# Altium project Capstone_Chess_Board.PrjPcb
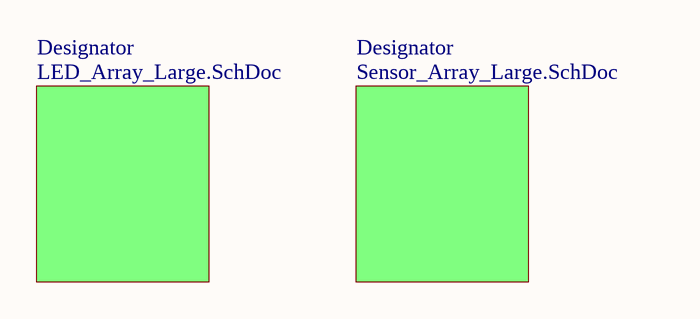
[diagram p0: Power_Supply_And_Connections.SchDoc]
4 sheets, 314 parts. Net scope: flat (ports and power ports of the same name join across sheets).
Board file: Chess_Board.PcbDoc
Sheets:
  Power_Supply_And_Connections.SchDoc
    Designator = LED_Array_Large.SchDoc
    Designator = Sensor_Array_Large.SchDoc
  Sensor_Array_No_Diodes.SchDoc

## Sheet Power_Supply_And_Connections.SchDoc
size A

### Sub-sheets
Designator = LED_Array_Large.SchDoc: no entries
Designator = Sensor_Array_Large.SchDoc: no entries

## Sheet LED_Array_Large.SchDoc
size C
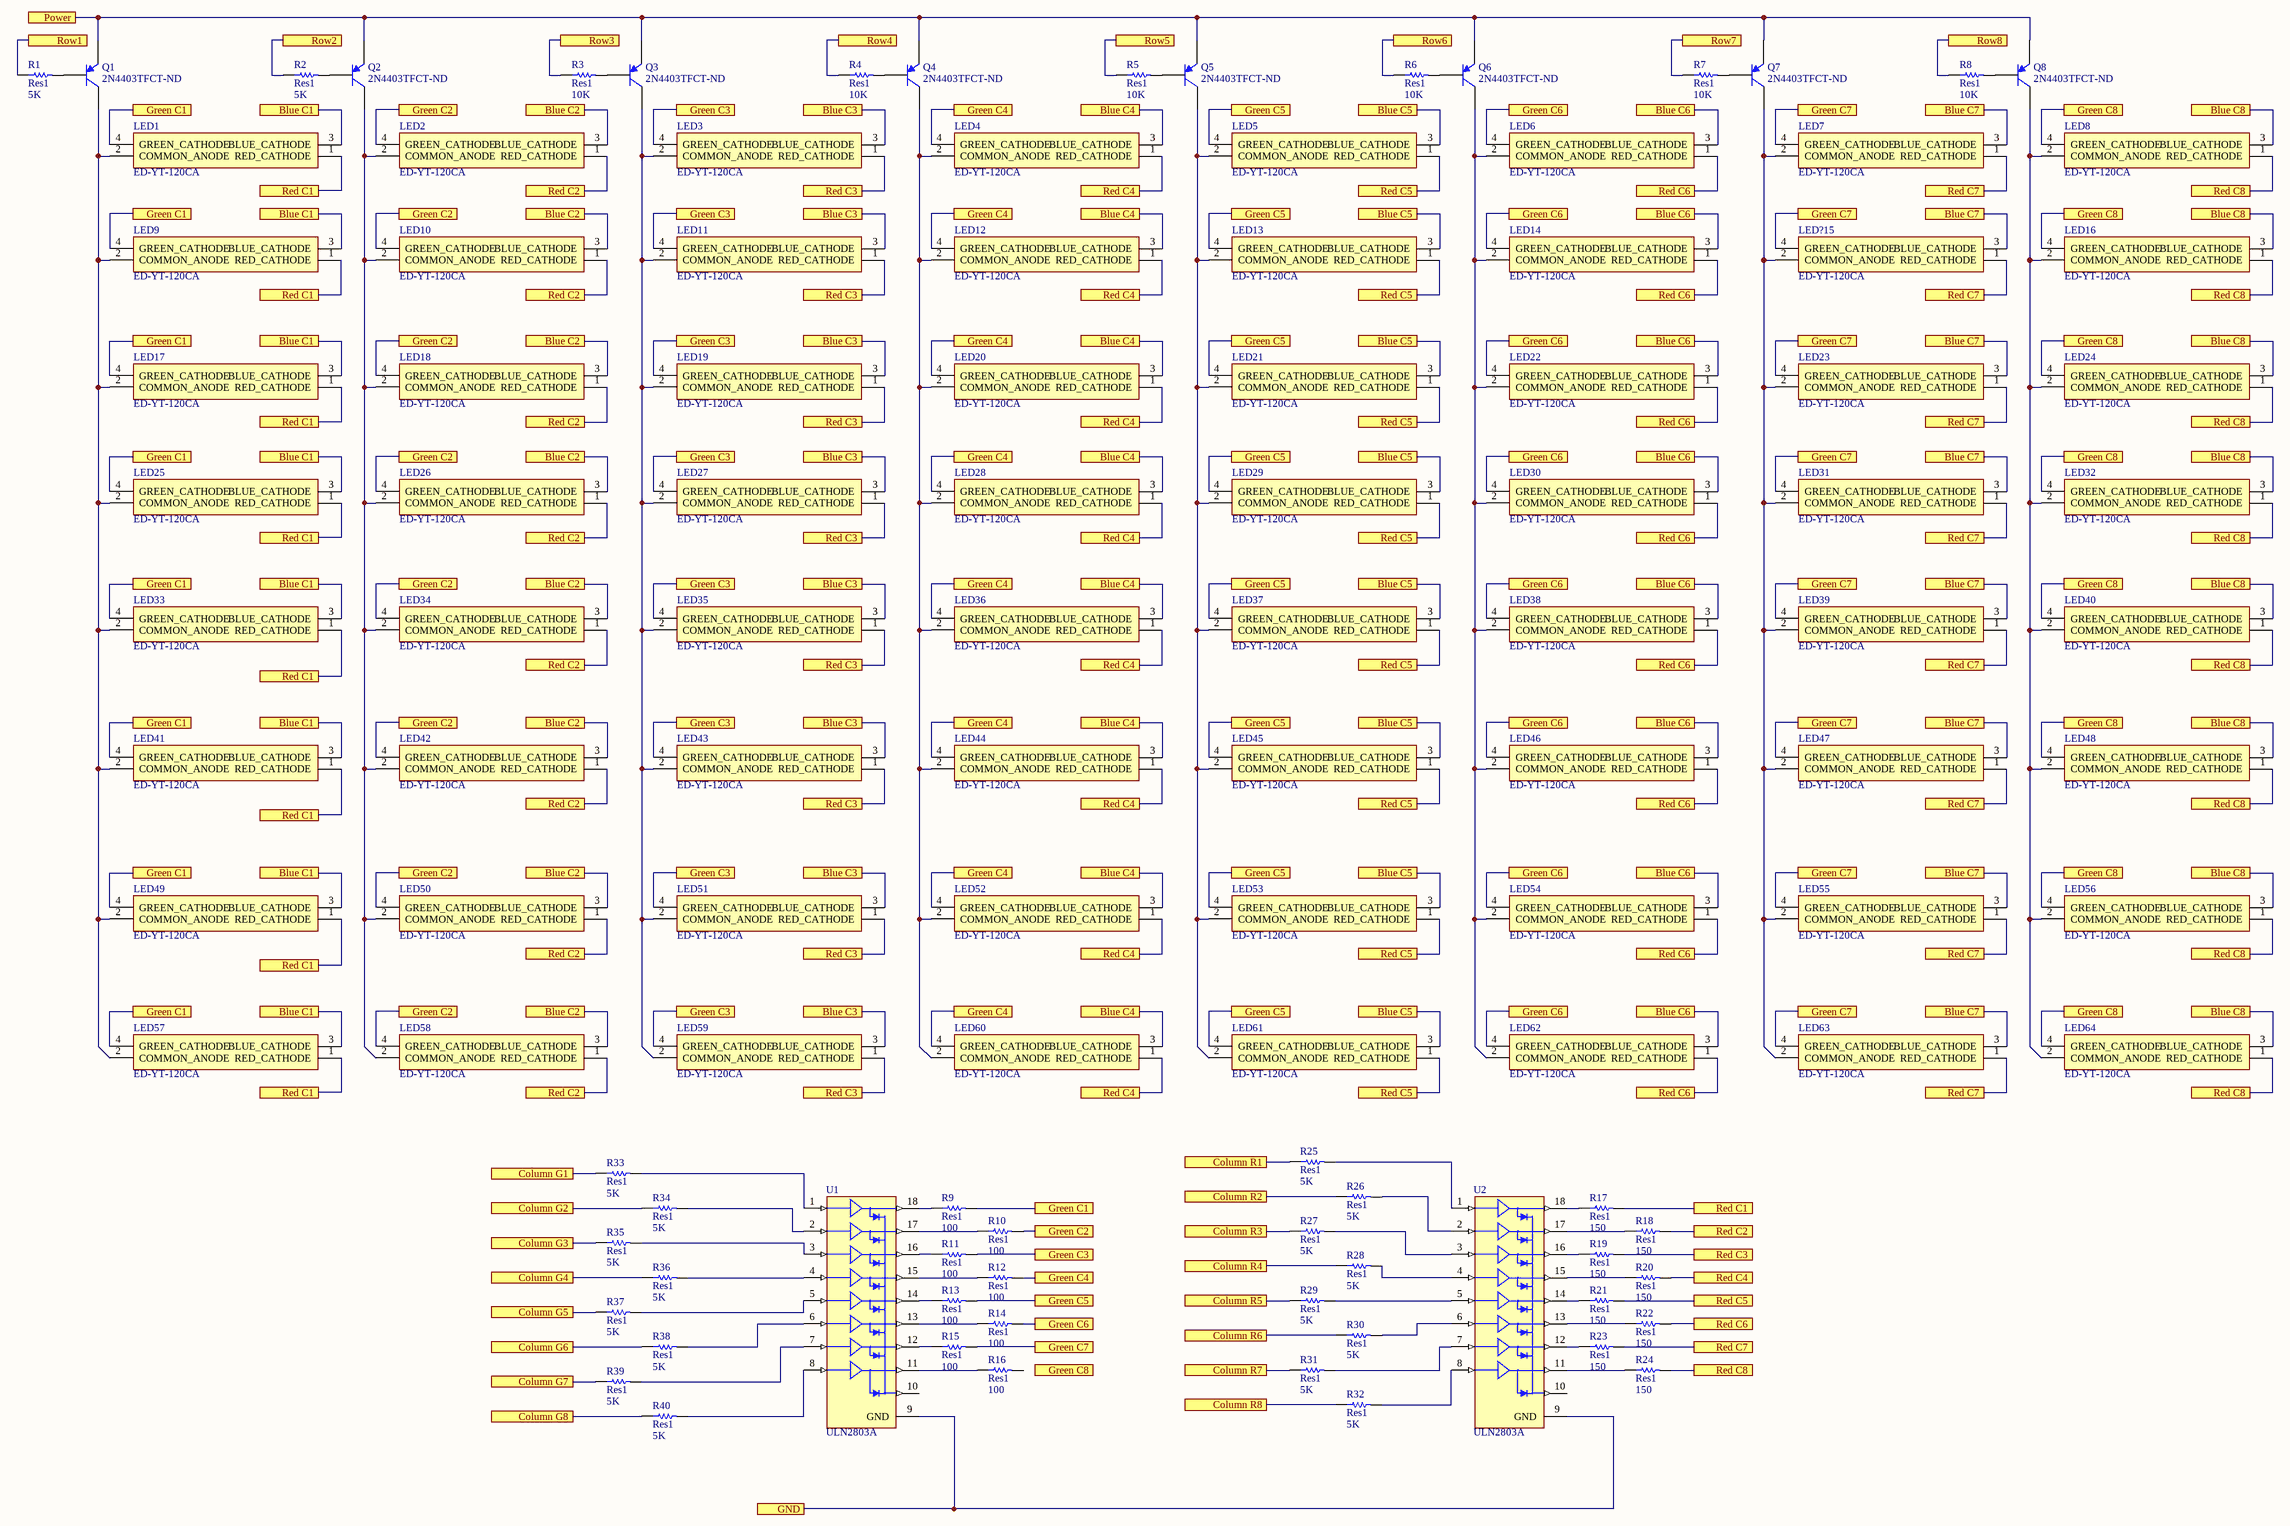
[diagram p1: LED_Array_Large.SchDoc]

### Parts
LED1  ED-YT-120CA  [L-154A4SUREQBFZGEC]
LED2  ED-YT-120CA  [L-154A4SUREQBFZGEC]
LED3  ED-YT-120CA  [L-154A4SUREQBFZGEC]
LED4  ED-YT-120CA  [L-154A4SUREQBFZGEC]
LED5  ED-YT-120CA  [L-154A4SUREQBFZGEC]
LED6  ED-YT-120CA  [L-154A4SUREQBFZGEC]
LED7  ED-YT-120CA  [L-154A4SUREQBFZGEC]
LED8  ED-YT-120CA  [L-154A4SUREQBFZGEC]
LED9  ED-YT-120CA  [L-154A4SUREQBFZGEC]
LED10  ED-YT-120CA  [L-154A4SUREQBFZGEC]
LED11  ED-YT-120CA  [L-154A4SUREQBFZGEC]
LED12  ED-YT-120CA  [L-154A4SUREQBFZGEC]
LED13  ED-YT-120CA  [L-154A4SUREQBFZGEC]
LED14  ED-YT-120CA  [L-154A4SUREQBFZGEC]
LED16  ED-YT-120CA  [L-154A4SUREQBFZGEC]
LED17  ED-YT-120CA  [L-154A4SUREQBFZGEC]
LED18  ED-YT-120CA  [L-154A4SUREQBFZGEC]
LED19  ED-YT-120CA  [L-154A4SUREQBFZGEC]
LED20  ED-YT-120CA  [L-154A4SUREQBFZGEC]
LED21  ED-YT-120CA  [L-154A4SUREQBFZGEC]
LED22  ED-YT-120CA  [L-154A4SUREQBFZGEC]
LED23  ED-YT-120CA  [L-154A4SUREQBFZGEC]
LED24  ED-YT-120CA  [L-154A4SUREQBFZGEC]
LED25  ED-YT-120CA  [L-154A4SUREQBFZGEC]
LED26  ED-YT-120CA  [L-154A4SUREQBFZGEC]
LED27  ED-YT-120CA  [L-154A4SUREQBFZGEC]
LED28  ED-YT-120CA  [L-154A4SUREQBFZGEC]
LED29  ED-YT-120CA  [L-154A4SUREQBFZGEC]
LED30  ED-YT-120CA  [L-154A4SUREQBFZGEC]
LED31  ED-YT-120CA  [L-154A4SUREQBFZGEC]
LED32  ED-YT-120CA  [L-154A4SUREQBFZGEC]
LED33  ED-YT-120CA  [L-154A4SUREQBFZGEC]
LED34  ED-YT-120CA  [L-154A4SUREQBFZGEC]
LED35  ED-YT-120CA  [L-154A4SUREQBFZGEC]
LED36  ED-YT-120CA  [L-154A4SUREQBFZGEC]
LED37  ED-YT-120CA  [L-154A4SUREQBFZGEC]
LED38  ED-YT-120CA  [L-154A4SUREQBFZGEC]
LED39  ED-YT-120CA  [L-154A4SUREQBFZGEC]
LED40  ED-YT-120CA  [L-154A4SUREQBFZGEC]
LED41  ED-YT-120CA  [L-154A4SUREQBFZGEC]
LED42  ED-YT-120CA  [L-154A4SUREQBFZGEC]
LED43  ED-YT-120CA  [L-154A4SUREQBFZGEC]
LED44  ED-YT-120CA  [L-154A4SUREQBFZGEC]
LED45  ED-YT-120CA  [L-154A4SUREQBFZGEC]
LED46  ED-YT-120CA  [L-154A4SUREQBFZGEC]
LED47  ED-YT-120CA  [L-154A4SUREQBFZGEC]
LED48  ED-YT-120CA  [L-154A4SUREQBFZGEC]
LED49  ED-YT-120CA  [L-154A4SUREQBFZGEC]
LED50  ED-YT-120CA  [L-154A4SUREQBFZGEC]
LED51  ED-YT-120CA  [L-154A4SUREQBFZGEC]
LED52  ED-YT-120CA  [L-154A4SUREQBFZGEC]
LED53  ED-YT-120CA  [L-154A4SUREQBFZGEC]
LED54  ED-YT-120CA  [L-154A4SUREQBFZGEC]
LED55  ED-YT-120CA  [L-154A4SUREQBFZGEC]
LED56  ED-YT-120CA  [L-154A4SUREQBFZGEC]
LED57  ED-YT-120CA  [L-154A4SUREQBFZGEC]
LED58  ED-YT-120CA  [L-154A4SUREQBFZGEC]
LED59  ED-YT-120CA  [L-154A4SUREQBFZGEC]
LED60  ED-YT-120CA  [L-154A4SUREQBFZGEC]
LED61  ED-YT-120CA  [L-154A4SUREQBFZGEC]
LED62  ED-YT-120CA  [L-154A4SUREQBFZGEC]
LED63  ED-YT-120CA  [L-154A4SUREQBFZGEC]
LED64  ED-YT-120CA  [L-154A4SUREQBFZGEC]
LED?15  ED-YT-120CA  [L-154A4SUREQBFZGEC]
Q1  2N4403TFCT-ND  [TO-92A]
Q2  2N4403TFCT-ND  [TO-92A]
Q3  2N4403TFCT-ND  [TO-92A]
Q4  2N4403TFCT-ND  [TO-92A]
Q5  2N4403TFCT-ND  [TO-92A]
Q6  2N4403TFCT-ND  [TO-92A]
Q7  2N4403TFCT-ND  [TO-92A]
Q8  2N4403TFCT-ND  [TO-92A]
R1  Res1  value 5K  [AXIAL-0.3]
R2  Res1  value 5K  [AXIAL-0.3]
R3  Res1  value 10K  [AXIAL-0.3]
R4  Res1  value 10K  [AXIAL-0.3]
R5  Res1  value 10K  [AXIAL-0.3]
R6  Res1  value 10K  [AXIAL-0.3]
R7  Res1  value 10K  [AXIAL-0.3]
R8  Res1  value 10K  [AXIAL-0.3]
R9  Res1  value 100  [AXIAL-0.3]
R10  Res1  value 100  [AXIAL-0.3]
R11  Res1  value 100  [AXIAL-0.3]
R12  Res1  value 100  [AXIAL-0.3]
R13  Res1  value 100  [AXIAL-0.3]
R14  Res1  value 100  [AXIAL-0.3]
R15  Res1  value 100  [AXIAL-0.3]
R16  Res1  value 100  [AXIAL-0.3]
R17  Res1  value 150  [AXIAL-0.3]
R18  Res1  value 150  [AXIAL-0.3]
R19  Res1  value 150  [AXIAL-0.3]
R20  Res1  value 150  [AXIAL-0.3]
R21  Res1  value 150  [AXIAL-0.3]
R22  Res1  value 150  [AXIAL-0.3]
R23  Res1  value 150  [AXIAL-0.3]
R24  Res1  value 150  [AXIAL-0.3]
R25  Res1  value 5K  [AXIAL-0.3]
R26  Res1  value 5K  [AXIAL-0.3]
R27  Res1  value 5K  [AXIAL-0.3]
R28  Res1  value 5K  [AXIAL-0.3]
R29  Res1  value 5K  [AXIAL-0.3]
R30  Res1  value 5K  [AXIAL-0.3]
R31  Res1  value 5K  [AXIAL-0.3]
R32  Res1  value 5K  [AXIAL-0.3]
R33  Res1  value 5K  [AXIAL-0.3]
R34  Res1  value 5K  [AXIAL-0.3]
R35  Res1  value 5K  [AXIAL-0.3]
R36  Res1  value 5K  [AXIAL-0.3]
R37  Res1  value 5K  [AXIAL-0.3]
R38  Res1  value 5K  [AXIAL-0.3]
R39  Res1  value 5K  [AXIAL-0.3]
R40  Res1  value 5K  [AXIAL-0.3]
U1  ULN2803A  [DIP850W46P254L2324H393Q18]
U2  ULN2803A  [DIP850W46P254L2324H393Q18]

### Ports
Blue C1, Blue C2, Blue C3, Blue C4, Blue C5, Blue C6, Blue C7, Blue C8, Column G1, Column G2, Column G3, Column G4, Column G5, Column G6, Column G7, Column G8, Column R1, Column R2, Column R3, Column R4, Column R5, Column R6, Column R7, Column R8, GND, Green C1, Green C2, Green C3, Green C4, Green C5, Green C6, Green C7, Green C8, Power, Red C1, Red C2, Red C3, Red C4, Red C5, Red C6, Red C7, Red C8, Row1, Row2, Row3, Row4, Row5, Row6, Row7, Row8

### Nets
NetLED1_1: LED1.1(RED_CATHODE) LED9.1(RED_CATHODE) LED17.1(RED_CATHODE) LED25.1(RED_CATHODE) LED33.1(RED_CATHODE) LED41.1(RED_CATHODE) LED49.1(RED_CATHODE) LED57.1(RED_CATHODE) R17.2 ; port Red C1
NetLED1_2: LED1.2(COMMON_ANODE) LED9.2(COMMON_ANODE) LED17.2(COMMON_ANODE) LED25.2(COMMON_ANODE) LED33.2(COMMON_ANODE) LED41.2(COMMON_ANODE) LED49.2(COMMON_ANODE) LED57.2(COMMON_ANODE) Q1.3(C)
NetLED1_3: LED1.3(BLUE_CATHODE) LED9.3(BLUE_CATHODE) LED17.3(BLUE_CATHODE) LED25.3(BLUE_CATHODE) LED33.3(BLUE_CATHODE) LED41.3(BLUE_CATHODE) LED49.3(BLUE_CATHODE) LED57.3(BLUE_CATHODE) ; port Blue C1
NetLED1_4: LED1.4(GREEN_CATHODE) LED9.4(GREEN_CATHODE) LED17.4(GREEN_CATHODE) LED25.4(GREEN_CATHODE) LED33.4(GREEN_CATHODE) LED41.4(GREEN_CATHODE) LED49.4(GREEN_CATHODE) LED57.4(GREEN_CATHODE) R9.2 ; port Green C1
NetLED2_1: LED2.1(RED_CATHODE) LED10.1(RED_CATHODE) LED18.1(RED_CATHODE) LED26.1(RED_CATHODE) LED34.1(RED_CATHODE) LED42.1(RED_CATHODE) LED50.1(RED_CATHODE) LED58.1(RED_CATHODE) R18.2 ; port Red C2
NetLED2_2: LED2.2(COMMON_ANODE) LED10.2(COMMON_ANODE) LED18.2(COMMON_ANODE) LED26.2(COMMON_ANODE) LED34.2(COMMON_ANODE) LED42.2(COMMON_ANODE) LED50.2(COMMON_ANODE) LED58.2(COMMON_ANODE) Q2.3(C)
NetLED2_3: LED2.3(BLUE_CATHODE) LED10.3(BLUE_CATHODE) LED18.3(BLUE_CATHODE) LED26.3(BLUE_CATHODE) LED34.3(BLUE_CATHODE) LED42.3(BLUE_CATHODE) LED50.3(BLUE_CATHODE) LED58.3(BLUE_CATHODE) ; port Blue C2
NetLED2_4: LED2.4(GREEN_CATHODE) LED10.4(GREEN_CATHODE) LED18.4(GREEN_CATHODE) LED26.4(GREEN_CATHODE) LED34.4(GREEN_CATHODE) LED42.4(GREEN_CATHODE) LED50.4(GREEN_CATHODE) LED58.4(GREEN_CATHODE) R10.2 ; port Green C2
NetLED3_1: LED3.1(RED_CATHODE) LED11.1(RED_CATHODE) LED19.1(RED_CATHODE) LED27.1(RED_CATHODE) LED35.1(RED_CATHODE) LED43.1(RED_CATHODE) LED51.1(RED_CATHODE) LED59.1(RED_CATHODE) R19.2 ; port Red C3
NetLED3_2: LED3.2(COMMON_ANODE) LED11.2(COMMON_ANODE) LED19.2(COMMON_ANODE) LED27.2(COMMON_ANODE) LED35.2(COMMON_ANODE) LED43.2(COMMON_ANODE) LED51.2(COMMON_ANODE) LED59.2(COMMON_ANODE) Q3.3(C)
NetLED3_3: LED3.3(BLUE_CATHODE) LED11.3(BLUE_CATHODE) LED19.3(BLUE_CATHODE) LED27.3(BLUE_CATHODE) LED35.3(BLUE_CATHODE) LED43.3(BLUE_CATHODE) LED51.3(BLUE_CATHODE) LED59.3(BLUE_CATHODE) ; port Blue C3
NetLED3_4: LED3.4(GREEN_CATHODE) LED11.4(GREEN_CATHODE) LED19.4(GREEN_CATHODE) LED27.4(GREEN_CATHODE) LED35.4(GREEN_CATHODE) LED43.4(GREEN_CATHODE) LED51.4(GREEN_CATHODE) LED59.4(GREEN_CATHODE) R11.2 ; port Green C3
NetLED4_1: LED4.1(RED_CATHODE) LED12.1(RED_CATHODE) LED20.1(RED_CATHODE) LED28.1(RED_CATHODE) LED36.1(RED_CATHODE) LED44.1(RED_CATHODE) LED52.1(RED_CATHODE) LED60.1(RED_CATHODE) R20.2 ; port Red C4
NetLED4_2: LED4.2(COMMON_ANODE) LED12.2(COMMON_ANODE) LED20.2(COMMON_ANODE) LED28.2(COMMON_ANODE) LED36.2(COMMON_ANODE) LED44.2(COMMON_ANODE) LED52.2(COMMON_ANODE) LED60.2(COMMON_ANODE) Q4.3(C)
NetLED4_3: LED4.3(BLUE_CATHODE) LED12.3(BLUE_CATHODE) LED20.3(BLUE_CATHODE) LED28.3(BLUE_CATHODE) LED36.3(BLUE_CATHODE) LED44.3(BLUE_CATHODE) LED52.3(BLUE_CATHODE) LED60.3(BLUE_CATHODE) ; port Blue C4
NetLED4_4: LED4.4(GREEN_CATHODE) LED12.4(GREEN_CATHODE) LED20.4(GREEN_CATHODE) LED28.4(GREEN_CATHODE) LED36.4(GREEN_CATHODE) LED44.4(GREEN_CATHODE) LED52.4(GREEN_CATHODE) LED60.4(GREEN_CATHODE) R12.2 ; port Green C4
NetLED5_1: LED5.1(RED_CATHODE) LED13.1(RED_CATHODE) LED21.1(RED_CATHODE) LED29.1(RED_CATHODE) LED37.1(RED_CATHODE) LED45.1(RED_CATHODE) LED53.1(RED_CATHODE) LED61.1(RED_CATHODE) R21.2 ; port Red C5
NetLED5_2: LED5.2(COMMON_ANODE) LED13.2(COMMON_ANODE) LED21.2(COMMON_ANODE) LED29.2(COMMON_ANODE) LED37.2(COMMON_ANODE) LED45.2(COMMON_ANODE) LED53.2(COMMON_ANODE) LED61.2(COMMON_ANODE) Q5.3(C)
NetLED5_3: LED5.3(BLUE_CATHODE) LED13.3(BLUE_CATHODE) LED21.3(BLUE_CATHODE) LED29.3(BLUE_CATHODE) LED37.3(BLUE_CATHODE) LED45.3(BLUE_CATHODE) LED53.3(BLUE_CATHODE) LED61.3(BLUE_CATHODE) ; port Blue C5
NetLED5_4: LED5.4(GREEN_CATHODE) LED13.4(GREEN_CATHODE) LED21.4(GREEN_CATHODE) LED29.4(GREEN_CATHODE) LED37.4(GREEN_CATHODE) LED45.4(GREEN_CATHODE) LED53.4(GREEN_CATHODE) LED61.4(GREEN_CATHODE) R13.2 ; port Green C5
NetLED6_1: LED6.1(RED_CATHODE) LED14.1(RED_CATHODE) LED22.1(RED_CATHODE) LED30.1(RED_CATHODE) LED38.1(RED_CATHODE) LED46.1(RED_CATHODE) LED54.1(RED_CATHODE) LED62.1(RED_CATHODE) R22.2 ; port Red C6
NetLED6_2: LED6.2(COMMON_ANODE) LED14.2(COMMON_ANODE) LED22.2(COMMON_ANODE) LED30.2(COMMON_ANODE) LED38.2(COMMON_ANODE) LED46.2(COMMON_ANODE) LED54.2(COMMON_ANODE) LED62.2(COMMON_ANODE) Q6.3(C)
NetLED6_3: LED6.3(BLUE_CATHODE) LED14.3(BLUE_CATHODE) LED22.3(BLUE_CATHODE) LED30.3(BLUE_CATHODE) LED38.3(BLUE_CATHODE) LED46.3(BLUE_CATHODE) LED54.3(BLUE_CATHODE) LED62.3(BLUE_CATHODE) ; port Blue C6
NetLED6_4: LED6.4(GREEN_CATHODE) LED14.4(GREEN_CATHODE) LED22.4(GREEN_CATHODE) LED30.4(GREEN_CATHODE) LED38.4(GREEN_CATHODE) LED46.4(GREEN_CATHODE) LED54.4(GREEN_CATHODE) LED62.4(GREEN_CATHODE) R14.2 ; port Green C6
NetLED7_1: LED7.1(RED_CATHODE) LED23.1(RED_CATHODE) LED31.1(RED_CATHODE) LED39.1(RED_CATHODE) LED47.1(RED_CATHODE) LED55.1(RED_CATHODE) LED63.1(RED_CATHODE) LED?15.1(RED_CATHODE) R23.2 ; port Red C7
NetLED7_2: LED7.2(COMMON_ANODE) LED23.2(COMMON_ANODE) LED31.2(COMMON_ANODE) LED39.2(COMMON_ANODE) LED47.2(COMMON_ANODE) LED55.2(COMMON_ANODE) LED63.2(COMMON_ANODE) LED?15.2(COMMON_ANODE) Q7.3(C)
NetLED7_3: LED7.3(BLUE_CATHODE) LED23.3(BLUE_CATHODE) LED31.3(BLUE_CATHODE) LED39.3(BLUE_CATHODE) LED47.3(BLUE_CATHODE) LED55.3(BLUE_CATHODE) LED63.3(BLUE_CATHODE) LED?15.3(BLUE_CATHODE) ; port Blue C7
NetLED7_4: LED7.4(GREEN_CATHODE) LED23.4(GREEN_CATHODE) LED31.4(GREEN_CATHODE) LED39.4(GREEN_CATHODE) LED47.4(GREEN_CATHODE) LED55.4(GREEN_CATHODE) LED63.4(GREEN_CATHODE) LED?15.4(GREEN_CATHODE) R15.2 ; port Green C7
NetLED8_1: LED8.1(RED_CATHODE) LED16.1(RED_CATHODE) LED24.1(RED_CATHODE) LED32.1(RED_CATHODE) LED40.1(RED_CATHODE) LED48.1(RED_CATHODE) LED56.1(RED_CATHODE) LED64.1(RED_CATHODE) R24.2 ; port Red C8
NetLED8_2: LED8.2(COMMON_ANODE) LED16.2(COMMON_ANODE) LED24.2(COMMON_ANODE) LED32.2(COMMON_ANODE) LED40.2(COMMON_ANODE) LED48.2(COMMON_ANODE) LED56.2(COMMON_ANODE) LED64.2(COMMON_ANODE) Q8.3(C)
NetLED8_3: LED8.3(BLUE_CATHODE) LED16.3(BLUE_CATHODE) LED24.3(BLUE_CATHODE) LED32.3(BLUE_CATHODE) LED40.3(BLUE_CATHODE) LED48.3(BLUE_CATHODE) LED56.3(BLUE_CATHODE) LED64.3(BLUE_CATHODE) ; port Blue C8
NetLED8_4: LED8.4(GREEN_CATHODE) LED16.4(GREEN_CATHODE) LED24.4(GREEN_CATHODE) LED32.4(GREEN_CATHODE) LED40.4(GREEN_CATHODE) LED48.4(GREEN_CATHODE) LED56.4(GREEN_CATHODE) LED64.4(GREEN_CATHODE) ; port Green C8
NetQ1_1: Q1.1(E) Q2.1(E) Q3.1(E) Q4.1(E) Q5.1(E) Q6.1(E) Q7.1(E) Q8.1(E) ; port Power
NetQ1_2: Q1.2(B) R1.2
NetQ2_2: Q2.2(B) R2.2
NetQ3_2: Q3.2(B) R3.2
NetQ4_2: Q4.2(B) R4.2
NetQ5_2: Q5.2(B) R5.2
NetQ6_2: Q6.2(B) R6.2
NetQ7_2: Q7.2(B) R7.2
NetQ8_2: Q8.2(B) R8.2
NetR1_1: R1.1 ; port Row1
NetR2_1: R2.1 ; port Row2
NetR3_1: R3.1 ; port Row3
NetR4_1: R4.1 ; port Row4
NetR5_1: R5.1 ; port Row5
NetR6_1: R6.1 ; port Row6
NetR7_1: R7.1 ; port Row7
NetR8_1: R8.1 ; port Row8
NetR9_1: R9.1 U1.18(OUT_1)
NetR10_1: R10.1 U1.17(OUT_2)
NetR11_1: R11.1 U1.16(OUT_3)
NetR12_1: R12.1 U1.15(OUT_4)
NetR13_1: R13.1 U1.14(OUT_5)
NetR14_1: R14.1 U1.13(OUT_6)
NetR15_1: R15.1 U1.12(OUT_7)
NetR16_1: R16.1 U1.11(OUT_8)
NetR17_1: R17.1 U2.18(OUT_1)
NetR18_1: R18.1 U2.17(OUT_2)
NetR19_1: R19.1 U2.16(OUT_3)
NetR20_1: R20.1 U2.15(OUT_4)
NetR21_1: R21.1 U2.14(OUT_5)
NetR22_1: R22.1 U2.13(OUT_6)
NetR23_1: R23.1 U2.12(OUT_7)
NetR24_1: R24.1 U2.11(OUT_8)
NetR25_1: R25.1 ; port Column R1
NetR25_2: R25.2 U2.1(IN_1)
NetR26_1: R26.1 ; port Column R2
NetR26_2: R26.2 U2.2(IN_2)
NetR27_1: R27.1 ; port Column R3
NetR27_2: R27.2 U2.3(IN_3)
NetR28_1: R28.1 ; port Column R4
NetR28_2: R28.2 U2.4(IN_4)
NetR29_1: R29.1 ; port Column R5
NetR29_2: R29.2 U2.5(IN_5)
NetR30_1: R30.1 ; port Column R6
NetR30_2: R30.2 U2.6(IN_6)
NetR31_1: R31.1 ; port Column R7
NetR31_2: R31.2 U2.7(IN_7)
NetR32_1: R32.1 ; port Column R8
NetR32_2: R32.2 U2.8(IN_8)
NetR33_1: R33.1 ; port Column G1
NetR33_2: R33.2 U1.1(IN_1)
NetR34_1: R34.1 ; port Column G2
NetR34_2: R34.2 U1.2(IN_2)
NetR35_1: R35.1 ; port Column G3
NetR35_2: R35.2 U1.3(IN_3)
NetR36_1: R36.1 ; port Column G4
NetR36_2: R36.2 U1.4(IN_4)
NetR37_1: R37.1 ; port Column G5
NetR37_2: R37.2 U1.5(IN_5)
NetR38_1: R38.1 ; port Column G6
NetR38_2: R38.2 U1.6(IN_6)
NetR39_1: R39.1 ; port Column G7
NetR39_2: R39.2 U1.7(IN_7)
NetR40_1: R40.1 ; port Column G8
NetR40_2: R40.2 U1.8(IN_8)
NetU1_9: U1.9(GND) U2.9(GND) ; port GND

Not connected (* = marked no-connect by the designer): R16 2; U1 10(COMMON); U2 10(COMMON)

### Library data of the parts
LED1-LED14 LED16-LED64 LED?15 = WP154A4SEJ3VBDZGW_CA: LED; Manufacturer_Name: Kingbright; Manufacturer_Part_Number: WP154A4SEJ3VBDZGW/CA; Datasheet Link: http://www.kingbrightusa.com/images/catalog/SPEC/WP154A4SEJ3VBDZGW-CA.pdf; Mouser Part Number: 604-WP154A43VBDZGWCA; Mouser Price/Stock: https://www.mouser.co.uk/ProductDetail/Kingbright/WP154A4SEJ3VBDZGW-CA/?qs=YCa%2FAAYMW01xRqZww6UuiQ%3D%3D; Arrow Part Number: WP154A4SEJ3VBDZGW/CA; Arrow Price/Stock: https://www.arrow.com/en/products/wp154a4sej3vbdzgwca/kingbright
Q1-Q8 = 2N3906: PNP General Purpose Amplifier; Published: 8-Jun-2000; LatestRevisionDate: 15-Jan-2003; LatestRevisionNote: PCB Footprint 'BCY-W3/D4.7' replaced; DatasheetVersion: 1997; PackageVersion: Sep-1998; PackageReference: TO-92A; Publisher: Altium Limited; PackageDescription: TO, Flat Index; 3 In-Line, Axial Leads; Body Dia. 4.5mm; Leads 0.51 x 0.48 mm (max); ComponentLink1Description: Manufacturer Link; ComponentLink1URL: http://www.fairchildsemi.com/; ComponentLink2Description: Datasheet; ComponentLink2URL: http://www.fairchildsemi.com/ds/2N%2F2N3906.pdf
R1-R40 = Res1: Resistor; Published: 8-Jun-2000; LatestRevisionDate: 17-Jul-2002; LatestRevisionNote: Re-released for DXP Platform.; PackageReference: AXIAL-0.3; Publisher: Altium Limited; PackageDescription: Axial Device, Thru-Hole; 2 Leads; 0.3 in Pin Spacing
U1 U2 = ULN2803A: Bipolar _BJT_ Transistor Array 8 NPN Darlington 50V 500mA 2.25W Through Hole 18-DIP; MF: STMicroelectronics; Value: *; MP: ULN2803A; Package: DIP-18 STMicroelectronics; Price: None; SnapEDA_Link: https://www.snapeda.com/parts/ULN2803A/STMicroelectronics/view-part/697285/?ref=snap; Availability: Unavailable

## Sheet Sensor_Array_Large.SchDoc
size C
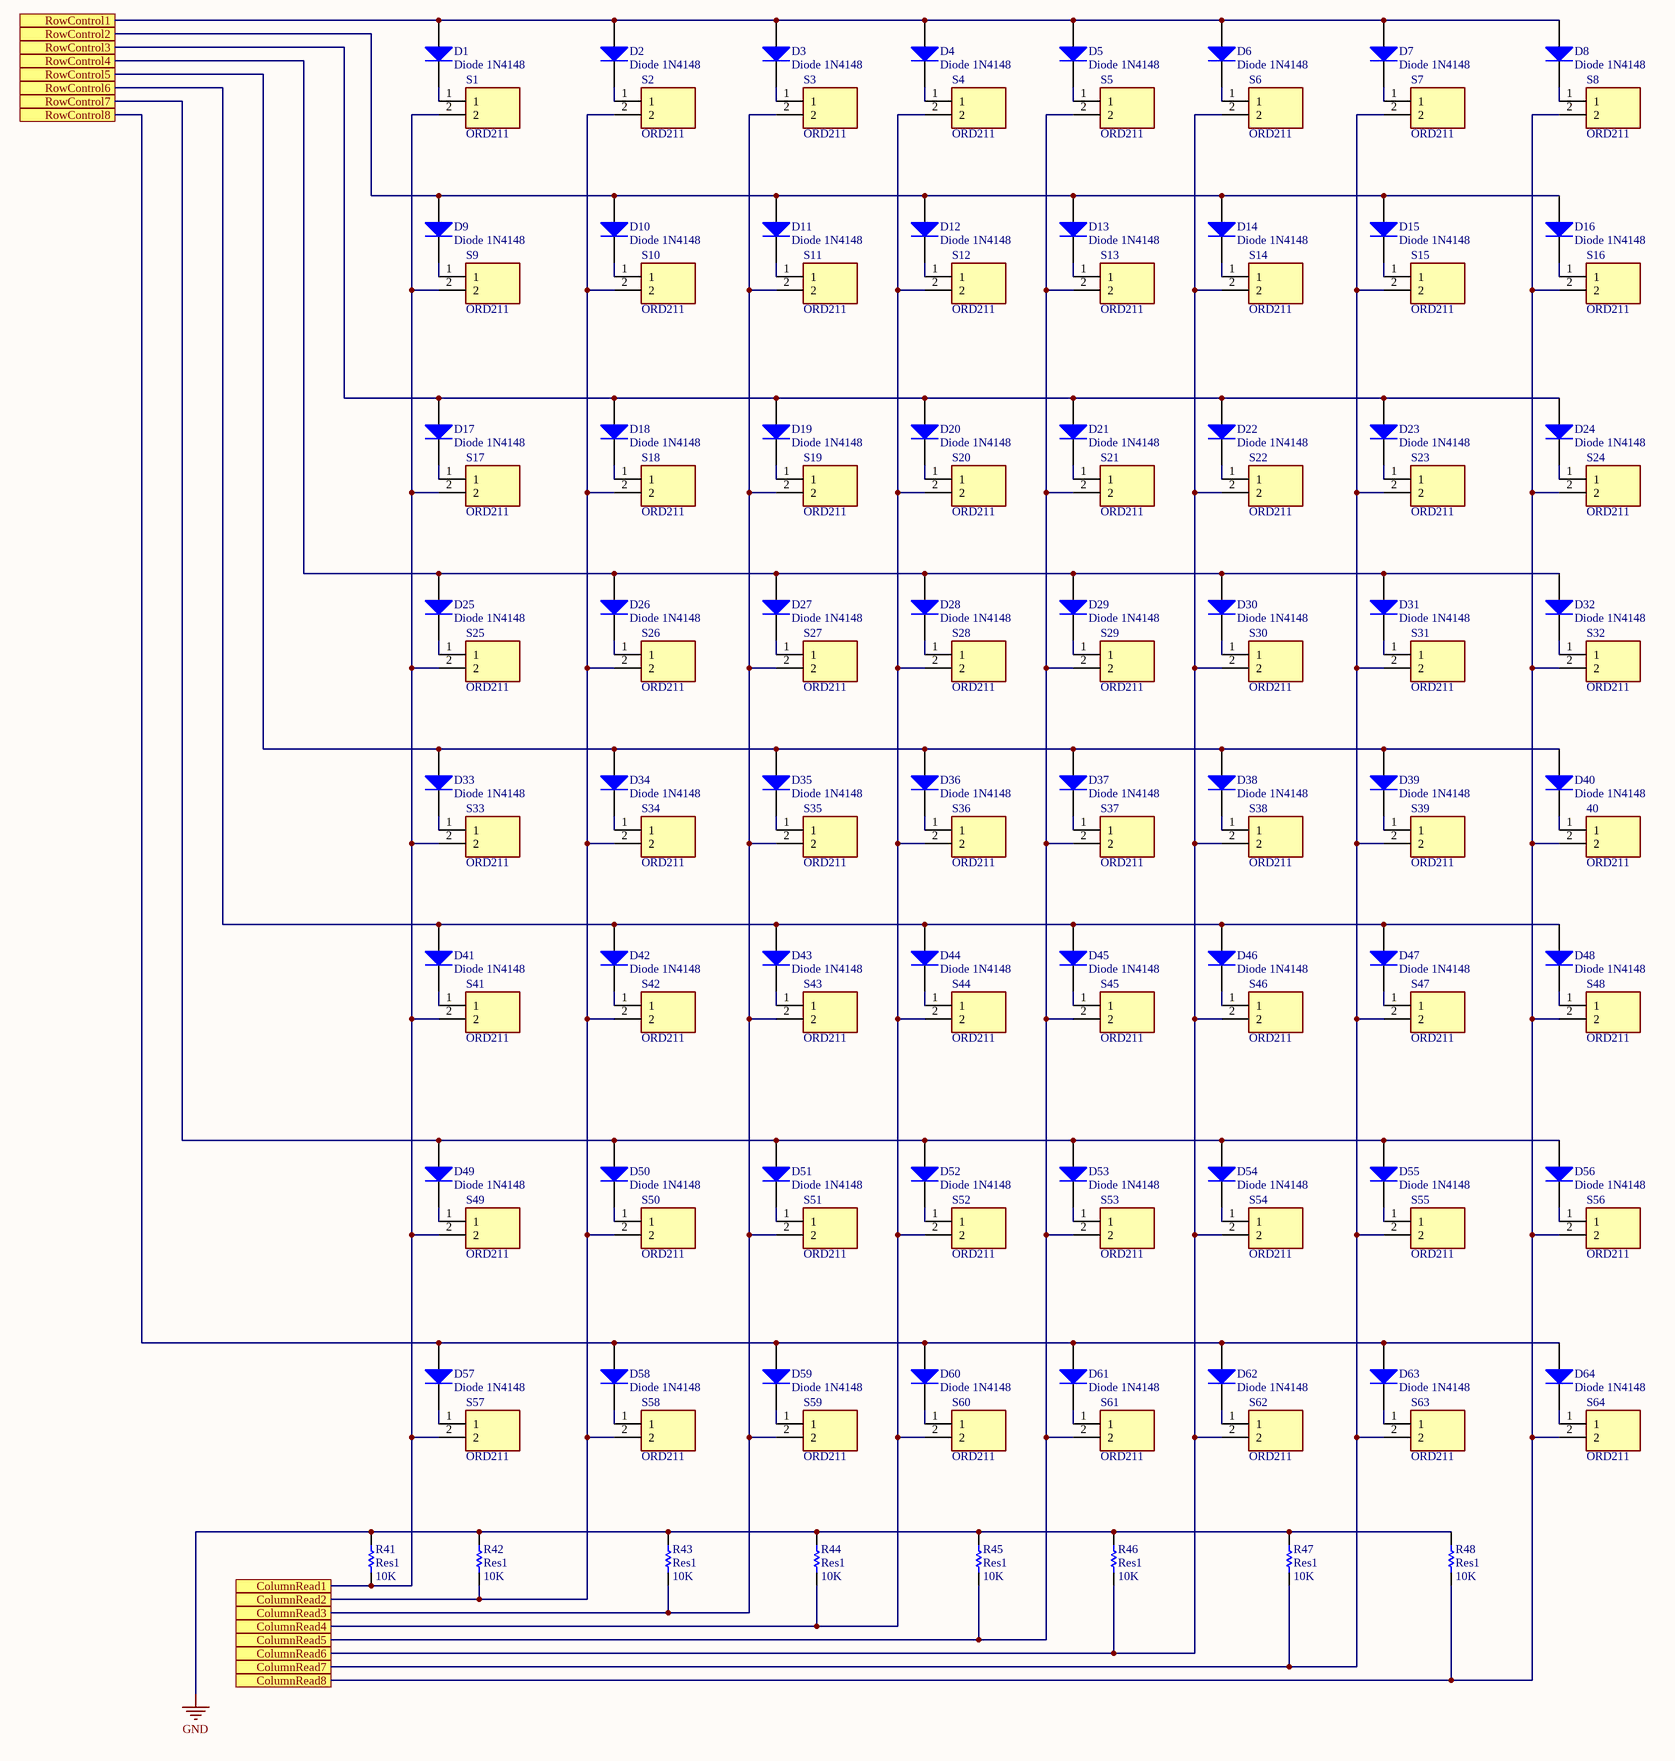
[diagram p2: Sensor_Array_Large.SchDoc]

### Parts
(Parts that share a designator on the sheet are numbered #1, #2 ... from top to bottom, then left to right.)
40  ORD211  [MDSM10R1025]
D1  Diode 1N4148  [DO-35]
D2  Diode 1N4148  [DO-35]
D3  Diode 1N4148  [DO-35]
D4  Diode 1N4148  [DO-35]
D5  Diode 1N4148  [DO-35]
D6  Diode 1N4148  [DO-35]
D7  Diode 1N4148  [DO-35]
D8  Diode 1N4148  [DO-35]
D9  Diode 1N4148  [DO-35]
D10  Diode 1N4148  [DO-35]
D11  Diode 1N4148  [DO-35]
D12  Diode 1N4148  [DO-35]
D13  Diode 1N4148  [DO-35]
D14  Diode 1N4148  [DO-35]
D15  Diode 1N4148  [DO-35]
D16  Diode 1N4148  [DO-35]
D17  Diode 1N4148  [DO-35]
D18  Diode 1N4148  [DO-35]
D19  Diode 1N4148  [DO-35]
D20  Diode 1N4148  [DO-35]
D21  Diode 1N4148  [DO-35]
D22  Diode 1N4148  [DO-35]
D23  Diode 1N4148  [DO-35]
D24  Diode 1N4148  [DO-35]
D25  Diode 1N4148  [DO-35]
D26  Diode 1N4148  [DO-35]
D27  Diode 1N4148  [DO-35]
D28  Diode 1N4148  [DO-35]
D29  Diode 1N4148  [DO-35]
D30  Diode 1N4148  [DO-35]
D31  Diode 1N4148  [DO-35]
D32  Diode 1N4148  [DO-35]
D33  Diode 1N4148  [DO-35]
D34  Diode 1N4148  [DO-35]
D35  Diode 1N4148  [DO-35]
D36  Diode 1N4148  [DO-35]
D37  Diode 1N4148  [DO-35]
D38  Diode 1N4148  [DO-35]
D39  Diode 1N4148  [DO-35]
D40  Diode 1N4148  [DO-35]
D41  Diode 1N4148  [DO-35]
D42  Diode 1N4148  [DO-35]
D43  Diode 1N4148  [DO-35]
D44  Diode 1N4148  [DO-35]
D45  Diode 1N4148  [DO-35]
D46  Diode 1N4148  [DO-35]
D47  Diode 1N4148  [DO-35]
D48  Diode 1N4148  [DO-35]
D49  Diode 1N4148  [DO-35]
D50  Diode 1N4148  [DO-35]
D51  Diode 1N4148  [DO-35]
D52  Diode 1N4148  [DO-35]
D53  Diode 1N4148  [DO-35]
D54  Diode 1N4148  [DO-35]
D55  Diode 1N4148  [DO-35]
D56  Diode 1N4148  [DO-35]
D57  Diode 1N4148  [DO-35]
D58  Diode 1N4148  [DO-35]
D59  Diode 1N4148  [DO-35]
D60  Diode 1N4148  [DO-35]
D61  Diode 1N4148  [DO-35]
D62  Diode 1N4148  [DO-35]
D63  Diode 1N4148  [DO-35]
D64  Diode 1N4148  [DO-35]
R41  Res1  value 10K  [AXIAL-0.3]
R42  Res1  value 10K  [AXIAL-0.3]
R43  Res1  value 10K  [AXIAL-0.3]
R44  Res1  value 10K  [AXIAL-0.3]
R45  Res1  value 10K  [AXIAL-0.3]
R46  Res1  value 10K  [AXIAL-0.3]
R47  Res1  value 10K  [AXIAL-0.3]
R48  Res1  value 10K  [AXIAL-0.3]
S1#1  ORD211  [MDSM10R1025]
S2#1  ORD211  [MDSM10R1025]
S3  ORD211  [MDSM10R1025]
S4  ORD211  [MDSM10R1025]
S5  ORD211  [MDSM10R1025]
S6  ORD211  [MDSM10R1025]
S7  ORD211  [MDSM10R1025]
S8  ORD211  [MDSM10R1025]
S9#1  ORD211  [MDSM10R1025]
S10#1  ORD211  [MDSM10R1025]
S11  ORD211  [MDSM10R1025]
S12  ORD211  [MDSM10R1025]
S13  ORD211  [MDSM10R1025]
S14  ORD211  [MDSM10R1025]
S15  ORD211  [MDSM10R1025]
S16  ORD211  [MDSM10R1025]
S17  ORD211  [MDSM10R1025]
S18  ORD211  [MDSM10R1025]
S19  ORD211  [MDSM10R1025]
S20  ORD211  [MDSM10R1025]
S21  ORD211  [MDSM10R1025]
S22  ORD211  [MDSM10R1025]
S23  ORD211  [MDSM10R1025]
S24  ORD211  [MDSM10R1025]
S25  ORD211  [MDSM10R1025]
S26  ORD211  [MDSM10R1025]
S27  ORD211  [MDSM10R1025]
S28  ORD211  [MDSM10R1025]
S29  ORD211  [MDSM10R1025]
S30  ORD211  [MDSM10R1025]
S31  ORD211  [MDSM10R1025]
S32  ORD211  [MDSM10R1025]
S33  ORD211  [MDSM10R1025]
S34  ORD211  [MDSM10R1025]
S35  ORD211  [MDSM10R1025]
S36  ORD211  [MDSM10R1025]
S37  ORD211  [MDSM10R1025]
S38  ORD211  [MDSM10R1025]
S39  ORD211  [MDSM10R1025]
S41  ORD211  [MDSM10R1025]
S42  ORD211  [MDSM10R1025]
S43  ORD211  [MDSM10R1025]
S44  ORD211  [MDSM10R1025]
S45  ORD211  [MDSM10R1025]
S46  ORD211  [MDSM10R1025]
S47  ORD211  [MDSM10R1025]
S48  ORD211  [MDSM10R1025]
S49  ORD211  [MDSM10R1025]
S50  ORD211  [MDSM10R1025]
S51  ORD211  [MDSM10R1025]
S52  ORD211  [MDSM10R1025]
S53  ORD211  [MDSM10R1025]
S54  ORD211  [MDSM10R1025]
S55  ORD211  [MDSM10R1025]
S56  ORD211  [MDSM10R1025]
S57  ORD211  [MDSM10R1025]
S58  ORD211  [MDSM10R1025]
S59  ORD211  [MDSM10R1025]
S60  ORD211  [MDSM10R1025]
S61  ORD211  [MDSM10R1025]
S62  ORD211  [MDSM10R1025]
S63  ORD211  [MDSM10R1025]
S64  ORD211  [MDSM10R1025]

### Ports
ColumnRead1, ColumnRead2, ColumnRead3, ColumnRead4, ColumnRead5, ColumnRead6, ColumnRead7, ColumnRead8, RowControl1, RowControl2, RowControl3, RowControl4, RowControl5, RowControl6, RowControl7, RowControl8

### Nets
GND: R41.2 R42.2 R43.2 R44.2 R45.2 R46.2 R47.2 R48.2
Net40_1: 40.1 D40.2(K)
Net40_2: 40.2 R48.1 S8.2 S16.2 S24.2 S32.2 S48.2 S56.2 S64.2 ; port ColumnRead8
NetD1_1: D1.1(A) D2.1(A) D3.1(A) D4.1(A) D5.1(A) D6.1(A) D7.1(A) D8.1(A) ; port RowControl1
NetD1_2: D1.2(K) S1#1.1
NetD2_2: D2.2(K) S2#1.1
NetD3_2: D3.2(K) S3.1
NetD4_2: D4.2(K) S4.1
NetD5_2: D5.2(K) S5.1
NetD6_2: D6.2(K) S6.1
NetD7_2: D7.2(K) S7.1
NetD8_2: D8.2(K) S8.1
NetD9_1: D9.1(A) D10.1(A) D11.1(A) D12.1(A) D13.1(A) D14.1(A) D15.1(A) D16.1(A) ; port RowControl2
NetD9_2: D9.2(K) S9#1.1
NetD10_2: D10.2(K) S10#1.1
NetD11_2: D11.2(K) S11.1
NetD12_2: D12.2(K) S12.1
NetD13_2: D13.2(K) S13.1
NetD14_2: D14.2(K) S14.1
NetD15_2: D15.2(K) S15.1
NetD16_2: D16.2(K) S16.1
NetD17_1: D17.1(A) D18.1(A) D19.1(A) D20.1(A) D21.1(A) D22.1(A) D23.1(A) D24.1(A) ; port RowControl3
NetD17_2: D17.2(K) S17.1
NetD18_2: D18.2(K) S18.1
NetD19_2: D19.2(K) S19.1
NetD20_2: D20.2(K) S20.1
NetD21_2: D21.2(K) S21.1
NetD22_2: D22.2(K) S22.1
NetD23_2: D23.2(K) S23.1
NetD24_2: D24.2(K) S24.1
NetD25_1: D25.1(A) D26.1(A) D27.1(A) D28.1(A) D29.1(A) D30.1(A) D31.1(A) D32.1(A) ; port RowControl4
NetD25_2: D25.2(K) S25.1
NetD26_2: D26.2(K) S26.1
NetD27_2: D27.2(K) S27.1
NetD28_2: D28.2(K) S28.1
NetD29_2: D29.2(K) S29.1
NetD30_2: D30.2(K) S30.1
NetD31_2: D31.2(K) S31.1
NetD32_2: D32.2(K) S32.1
NetD33_1: D33.1(A) D34.1(A) D35.1(A) D36.1(A) D37.1(A) D38.1(A) D39.1(A) D40.1(A) ; port RowControl5
NetD33_2: D33.2(K) S33.1
NetD34_2: D34.2(K) S34.1
NetD35_2: D35.2(K) S35.1
NetD36_2: D36.2(K) S36.1
NetD37_2: D37.2(K) S37.1
NetD38_2: D38.2(K) S38.1
NetD39_2: D39.2(K) S39.1
NetD41_1: D41.1(A) D42.1(A) D43.1(A) D44.1(A) D45.1(A) D46.1(A) D47.1(A) D48.1(A) ; port RowControl6
NetD41_2: D41.2(K) S41.1
NetD42_2: D42.2(K) S42.1
NetD43_2: D43.2(K) S43.1
NetD44_2: D44.2(K) S44.1
NetD45_2: D45.2(K) S45.1
NetD46_2: D46.2(K) S46.1
NetD47_2: D47.2(K) S47.1
NetD48_2: D48.2(K) S48.1
NetD49_1: D49.1(A) D50.1(A) D51.1(A) D52.1(A) D53.1(A) D54.1(A) D55.1(A) D56.1(A) ; port RowControl7
NetD49_2: D49.2(K) S49.1
NetD50_2: D50.2(K) S50.1
NetD51_2: D51.2(K) S51.1
NetD52_2: D52.2(K) S52.1
NetD53_2: D53.2(K) S53.1
NetD54_2: D54.2(K) S54.1
NetD55_2: D55.2(K) S55.1
NetD56_2: D56.2(K) S56.1
NetD57_1: D57.1(A) D58.1(A) D59.1(A) D60.1(A) D61.1(A) D62.1(A) D63.1(A) D64.1(A) ; port RowControl8
NetD57_2: D57.2(K) S57.1
NetD58_2: D58.2(K) S58.1
NetD59_2: D59.2(K) S59.1
NetD60_2: D60.2(K) S60.1
NetD61_2: D61.2(K) S61.1
NetD62_2: D62.2(K) S62.1
NetD63_2: D63.2(K) S63.1
NetD64_2: D64.2(K) S64.1
NetR41_1: R41.1 S1#1.2 S9#1.2 S17.2 S25.2 S33.2 S41.2 S49.2 S57.2 ; port ColumnRead1
NetR42_1: R42.1 S2#1.2 S10#1.2 S18.2 S26.2 S34.2 S42.2 S50.2 S58.2 ; port ColumnRead2
NetR43_1: R43.1 S3.2 S11.2 S19.2 S27.2 S35.2 S43.2 S51.2 S59.2 ; port ColumnRead3
NetR44_1: R44.1 S4.2 S12.2 S20.2 S28.2 S36.2 S44.2 S52.2 S60.2 ; port ColumnRead4
NetR45_1: R45.1 S5.2 S13.2 S21.2 S29.2 S37.2 S45.2 S53.2 S61.2 ; port ColumnRead5
NetR46_1: R46.1 S6.2 S14.2 S22.2 S30.2 S38.2 S46.2 S54.2 S62.2 ; port ColumnRead6
NetR47_1: R47.1 S7.2 S15.2 S23.2 S31.2 S39.2 S47.2 S55.2 S63.2 ; port ColumnRead7

### Library data of the parts
40 S1#1 S2#1 S3-S8 S9#1 S10#1 S11-S39 S41-S64 = MDSM-10R-10-25: Switch; Manufacturer_Name: LITTELFUSE; Datasheet Link: https://www.littelfuse.com/~/media/electronics/datasheets/reed_switches/littelfuse_reed_switches_mdsm_10_datasheet.pdf.pdf; Height: 2mm; Manufacturer_Part_Number: MDSM-10R-10-25; Mouser Part Number: 934-MDSM-10R10-25; Mouser Price/Stock: https://www.mouser.co.uk/ProductDetail/Littelfuse/MDSM-10R-10-25?qs=nyo4TFax6Nce6Y4AmbWmcw%3D%3D; Arrow Part Number: MDSM-10R-10-25; Arrow Price/Stock: https://www.arrow.com/en/products/mdsm-10r-10-25/littelfuse
D1-D64 = Diode 1N4148: High Conductance Fast Diode; Published: 8-Jun-2000; LatestRevisionDate: 17-Jul-2002; LatestRevisionNote: Re-released for DXP Platform.; DatasheetVersion: 1997; PackageReference: DO-35; Publisher: Altium Limited; PackageDescription: Diode, Axial; Body 3.8 x 1.9 mm (LxDia. max), Lead Dia. 0.53 mm (max); Code_JEDEC: DO-204-AH; ComponentLink1Description: Manufacturer Link; ComponentLink1URL: http://www.fairchildsemi.com/; ComponentLink2Description: Datasheet; ComponentLink2URL: http://www.fairchildsemi.com/ds/1N%2F1N4148.pdf
R41-R48 = Res1: Resistor; Published: 8-Jun-2000; LatestRevisionDate: 17-Jul-2002; LatestRevisionNote: Re-released for DXP Platform.; PackageReference: AXIAL-0.3; Publisher: Altium Limited; PackageDescription: Axial Device, Thru-Hole; 2 Leads; 0.3 in Pin Spacing

## Sheet Sensor_Array_No_Diodes.SchDoc
size C
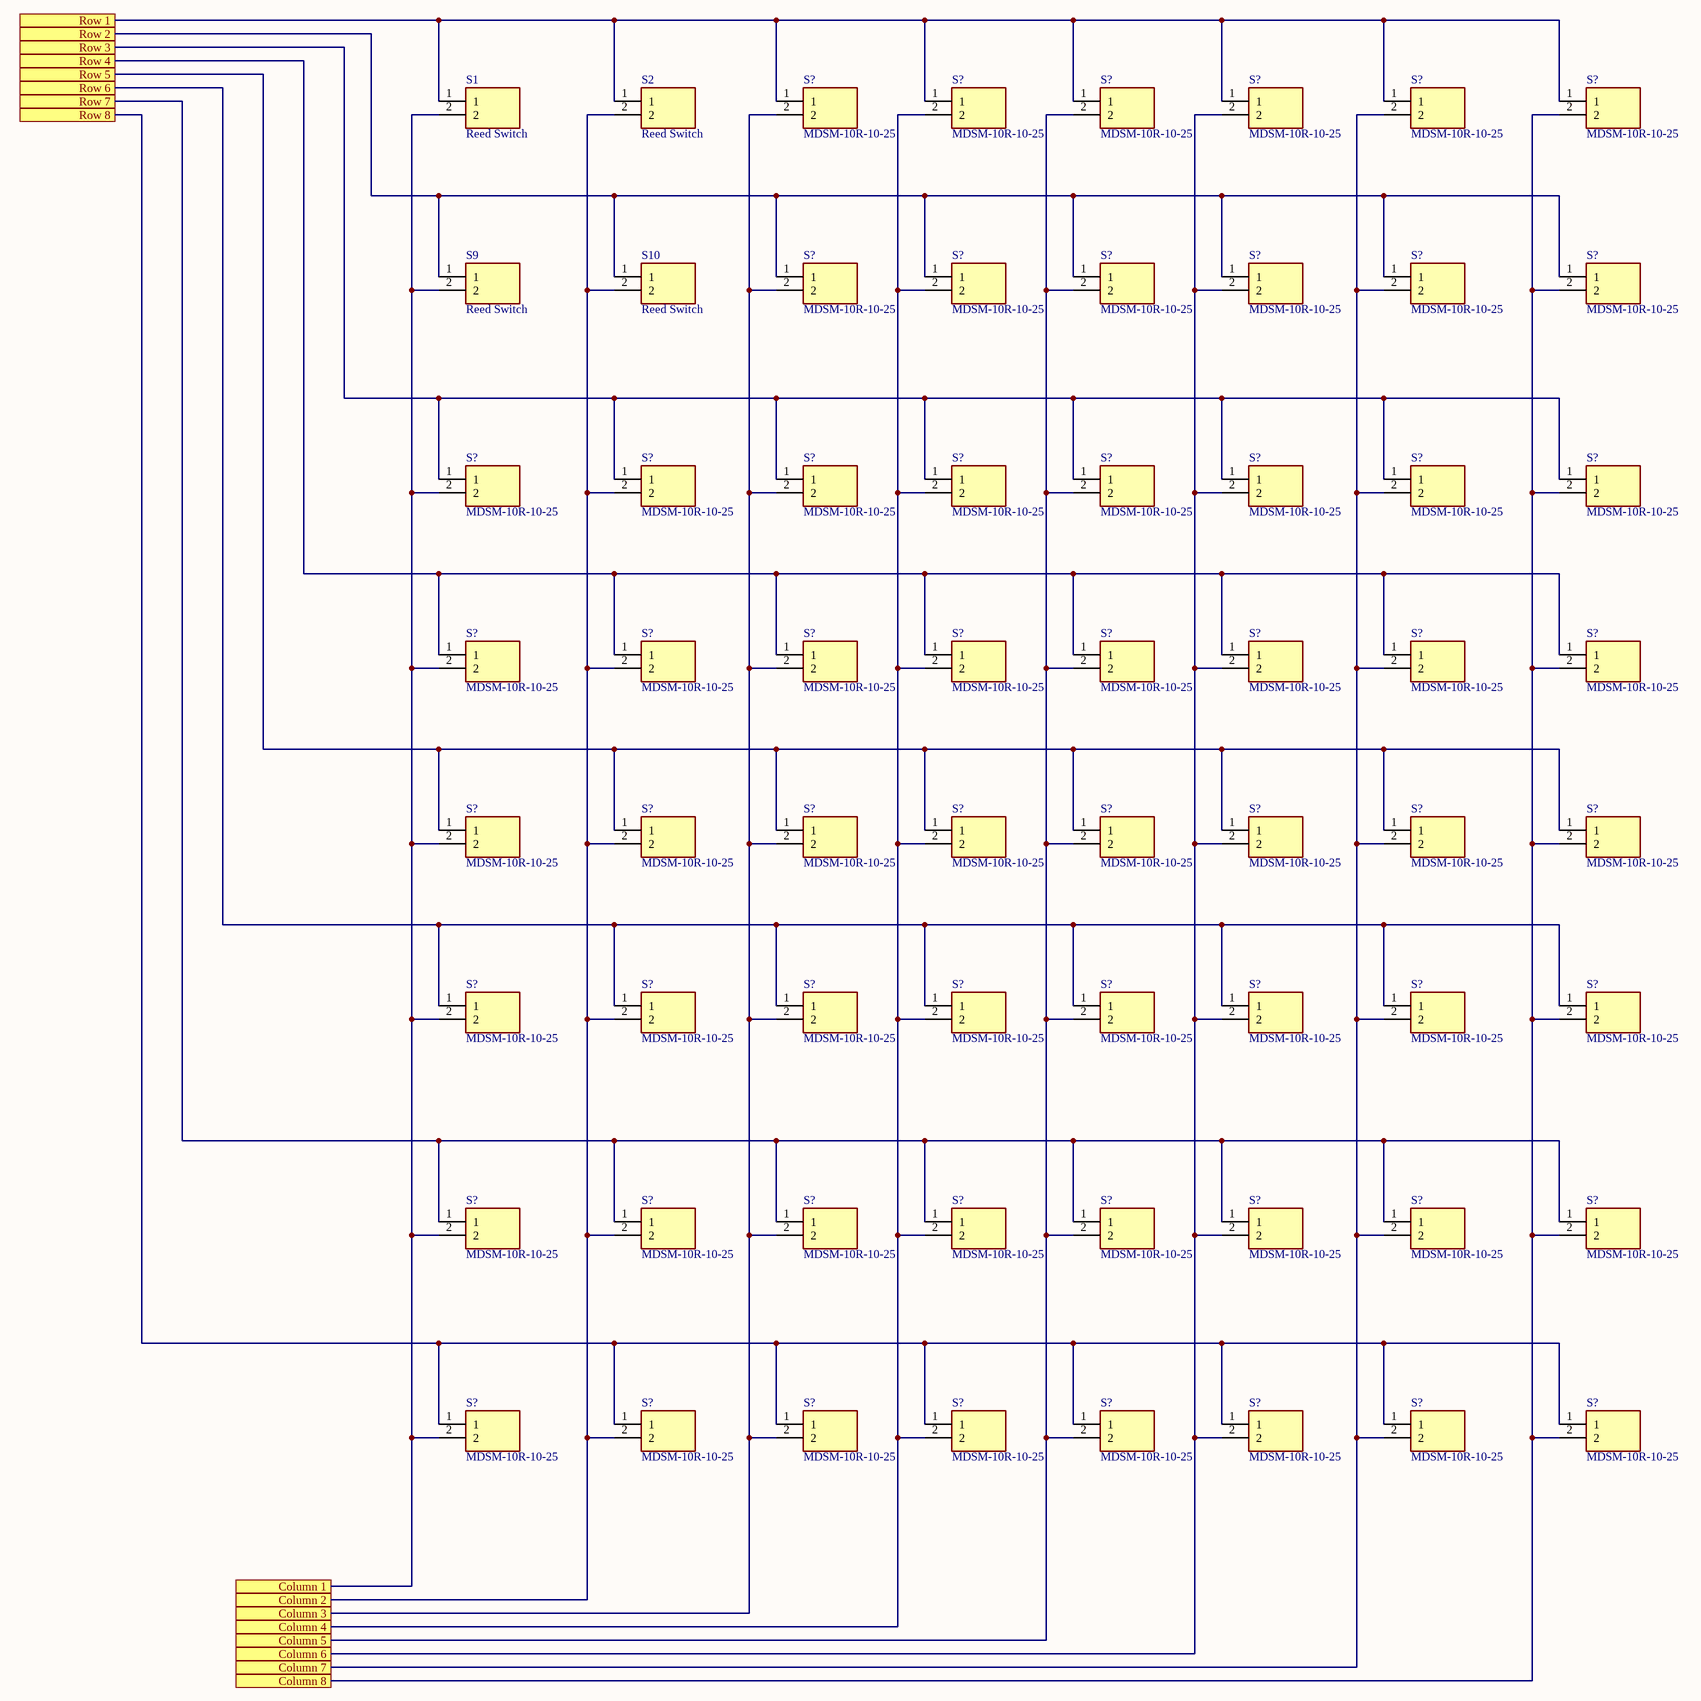
[diagram p3: Sensor_Array_No_Diodes.SchDoc]

### Parts
(Parts that share a designator on the sheet are numbered #1, #2 ... from top to bottom, then left to right.)
S1#2  Reed Switch  [MDSM10R1025]
S2#2  Reed Switch  [MDSM10R1025]
S9#2  Reed Switch  [MDSM10R1025]
S10#2  Reed Switch  [MDSM10R1025]
S?#1  MDSM-10R-10-25  [MDSM10R1025]
S?#2  MDSM-10R-10-25  [MDSM10R1025]
S?#3  MDSM-10R-10-25  [MDSM10R1025]
S?#4  MDSM-10R-10-25  [MDSM10R1025]
S?#5  MDSM-10R-10-25  [MDSM10R1025]
S?#6  MDSM-10R-10-25  [MDSM10R1025]
S?#7  MDSM-10R-10-25  [MDSM10R1025]
S?#8  MDSM-10R-10-25  [MDSM10R1025]
S?#9  MDSM-10R-10-25  [MDSM10R1025]
S?#10  MDSM-10R-10-25  [MDSM10R1025]
S?#11  MDSM-10R-10-25  [MDSM10R1025]
S?#12  MDSM-10R-10-25  [MDSM10R1025]
S?#13  MDSM-10R-10-25  [MDSM10R1025]
S?#14  MDSM-10R-10-25  [MDSM10R1025]
S?#15  MDSM-10R-10-25  [MDSM10R1025]
S?#16  MDSM-10R-10-25  [MDSM10R1025]
S?#17  MDSM-10R-10-25  [MDSM10R1025]
S?#18  MDSM-10R-10-25  [MDSM10R1025]
S?#19  MDSM-10R-10-25  [MDSM10R1025]
S?#20  MDSM-10R-10-25  [MDSM10R1025]
S?#21  MDSM-10R-10-25  [MDSM10R1025]
S?#22  MDSM-10R-10-25  [MDSM10R1025]
S?#23  MDSM-10R-10-25  [MDSM10R1025]
S?#24  MDSM-10R-10-25  [MDSM10R1025]
S?#25  MDSM-10R-10-25  [MDSM10R1025]
S?#26  MDSM-10R-10-25  [MDSM10R1025]
S?#27  MDSM-10R-10-25  [MDSM10R1025]
S?#28  MDSM-10R-10-25  [MDSM10R1025]
S?#29  MDSM-10R-10-25  [MDSM10R1025]
S?#30  MDSM-10R-10-25  [MDSM10R1025]
S?#31  MDSM-10R-10-25  [MDSM10R1025]
S?#32  MDSM-10R-10-25  [MDSM10R1025]
S?#33  MDSM-10R-10-25  [MDSM10R1025]
S?#34  MDSM-10R-10-25  [MDSM10R1025]
S?#35  MDSM-10R-10-25  [MDSM10R1025]
S?#36  MDSM-10R-10-25  [MDSM10R1025]
S?#37  MDSM-10R-10-25  [MDSM10R1025]
S?#38  MDSM-10R-10-25  [MDSM10R1025]
S?#39  MDSM-10R-10-25  [MDSM10R1025]
S?#40  MDSM-10R-10-25  [MDSM10R1025]
S?#41  MDSM-10R-10-25  [MDSM10R1025]
S?#42  MDSM-10R-10-25  [MDSM10R1025]
S?#43  MDSM-10R-10-25  [MDSM10R1025]
S?#44  MDSM-10R-10-25  [MDSM10R1025]
S?#45  MDSM-10R-10-25  [MDSM10R1025]
S?#46  MDSM-10R-10-25  [MDSM10R1025]
S?#47  MDSM-10R-10-25  [MDSM10R1025]
S?#48  MDSM-10R-10-25  [MDSM10R1025]
S?#49  MDSM-10R-10-25  [MDSM10R1025]
S?#50  MDSM-10R-10-25  [MDSM10R1025]
S?#51  MDSM-10R-10-25  [MDSM10R1025]
S?#52  MDSM-10R-10-25  [MDSM10R1025]
S?#53  MDSM-10R-10-25  [MDSM10R1025]
S?#54  MDSM-10R-10-25  [MDSM10R1025]
S?#55  MDSM-10R-10-25  [MDSM10R1025]
S?#56  MDSM-10R-10-25  [MDSM10R1025]
S?#57  MDSM-10R-10-25  [MDSM10R1025]
S?#58  MDSM-10R-10-25  [MDSM10R1025]
S?#59  MDSM-10R-10-25  [MDSM10R1025]
S?#60  MDSM-10R-10-25  [MDSM10R1025]

### Ports
Column 1, Column 2, Column 3, Column 4, Column 5, Column 6, Column 7, Column 8, Row 1, Row 2, Row 3, Row 4, Row 5, Row 6, Row 7, Row 8

### Nets
NetS1#2_1: S1#2.1 S2#2.1 S?#1.1 S?#2.1 S?#3.1 S?#4.1 S?#5.1 S?#6.1 ; port Row 1
NetS1#2_2: S1#2.2 S9#2.2 S?#13.2 S?#21.2 S?#29.2 S?#37.2 S?#45.2 S?#53.2 ; port Column 1
NetS2#2_2: S2#2.2 S10#2.2 S?#14.2 S?#22.2 S?#30.2 S?#38.2 S?#46.2 S?#54.2 ; port Column 2
NetS9#2_1: S9#2.1 S10#2.1 S?#7.1 S?#8.1 S?#9.1 S?#10.1 S?#11.1 S?#12.1 ; port Row 2
NetS?#1_2: S?#1.2 S?#7.2 S?#15.2 S?#23.2 S?#31.2 S?#39.2 S?#47.2 S?#55.2 ; port Column 3
NetS?#2_2: S?#2.2 S?#8.2 S?#16.2 S?#24.2 S?#32.2 S?#40.2 S?#48.2 S?#56.2 ; port Column 4
NetS?#3_2: S?#3.2 S?#9.2 S?#17.2 S?#25.2 S?#33.2 S?#41.2 S?#49.2 S?#57.2 ; port Column 5
NetS?#4_2: S?#4.2 S?#10.2 S?#18.2 S?#26.2 S?#34.2 S?#42.2 S?#50.2 S?#58.2 ; port Column 6
NetS?#5_2: S?#5.2 S?#11.2 S?#19.2 S?#27.2 S?#35.2 S?#43.2 S?#51.2 S?#59.2 ; port Column 7
NetS?#6_2: S?#6.2 S?#12.2 S?#20.2 S?#28.2 S?#36.2 S?#44.2 S?#52.2 S?#60.2 ; port Column 8
NetS?#13_1: S?#13.1 S?#14.1 S?#15.1 S?#16.1 S?#17.1 S?#18.1 S?#19.1 S?#20.1 ; port Row 3
NetS?#21_1: S?#21.1 S?#22.1 S?#23.1 S?#24.1 S?#25.1 S?#26.1 S?#27.1 S?#28.1 ; port Row 4
NetS?#29_1: S?#29.1 S?#30.1 S?#31.1 S?#32.1 S?#33.1 S?#34.1 S?#35.1 S?#36.1 ; port Row 5
NetS?#37_1: S?#37.1 S?#38.1 S?#39.1 S?#40.1 S?#41.1 S?#42.1 S?#43.1 S?#44.1 ; port Row 6
NetS?#45_1: S?#45.1 S?#46.1 S?#47.1 S?#48.1 S?#49.1 S?#50.1 S?#51.1 S?#52.1 ; port Row 7
NetS?#53_1: S?#53.1 S?#54.1 S?#55.1 S?#56.1 S?#57.1 S?#58.1 S?#59.1 S?#60.1 ; port Row 8

### Library data of the parts
S1#2 S2#2 S9#2 S10#2 S?#1-S?#60 = MDSM-10R-10-25: Switch; Manufacturer_Name: LITTELFUSE; Datasheet Link: https://www.littelfuse.com/~/media/electronics/datasheets/reed_switches/littelfuse_reed_switches_mdsm_10_datasheet.pdf.pdf; Height: 2mm; Manufacturer_Part_Number: MDSM-10R-10-25; Mouser Part Number: 934-MDSM-10R10-25; Mouser Price/Stock: https://www.mouser.co.uk/ProductDetail/Littelfuse/MDSM-10R-10-25?qs=nyo4TFax6Nce6Y4AmbWmcw%3D%3D; Arrow Part Number: MDSM-10R-10-25; Arrow Price/Stock: https://www.arrow.com/en/products/mdsm-10r-10-25/littelfuse